# EAGLE design working (EAGLE 6.6.0)
COMPANY: ADAFRUIT INDUSTRIES; DRAWN: KTOWN; REV: B
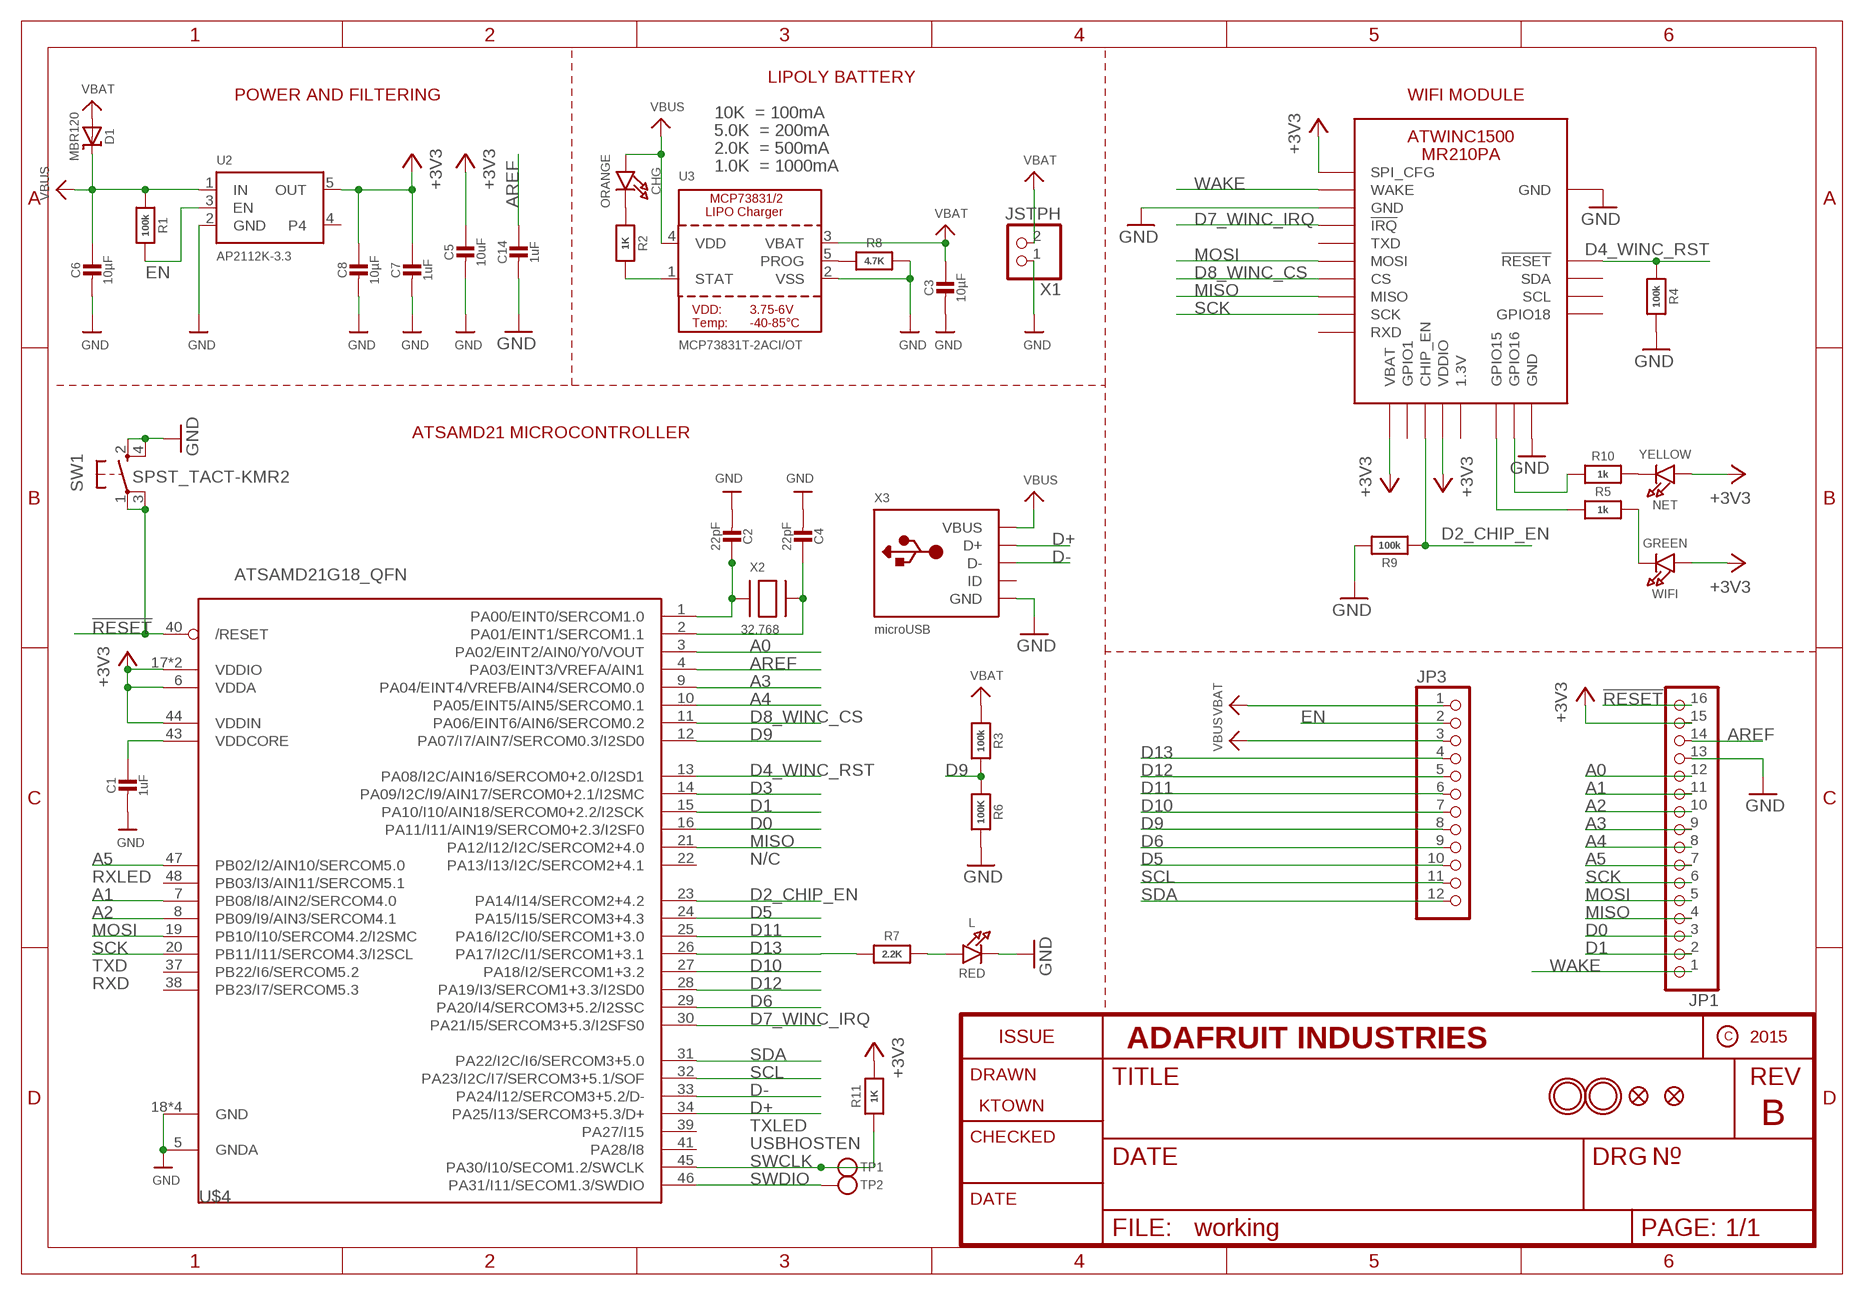
[diagram p0: schematic, sheet 1]

## Parts
C1  1uF  CAP_CERAMIC0603_NO  [0603-NO]
C2  22pF  CAP_CERAMIC0603_NO  [0603-NO]
C3  10µF  CAP_CERAMIC0805-NOOUTLINE  [0805-NO]
C4  22pF  CAP_CERAMIC0603_NO  [0603-NO]
C5  10uF  CAP_CERAMIC0805-NOOUTLINE  [0805-NO]
C6  10µF  CAP_CERAMIC0805-NOOUTLINE  [0805-NO]
C7  1uF  CAP_CERAMIC0603_NO  [0603-NO]
C8  10µF  CAP_CERAMIC0805-NOOUTLINE  [0805-NO]
C14  1uF  CAP_CERAMIC0603_NO  [0603-NO]
CHG  ORANGE  LED0805_NOOUTLINE  [CHIPLED_0805_NOOUTLINE]
D1  MBR120  DIODE-SCHOTTKYSOD-123  [SOD-123]
JP1  HEADER-1X16ROUND  [1X16_ROUND]
JP3  HEADER-1X12  [1X12_ROUND]
L  RED  LED0805_NOOUTLINE  [CHIPLED_0805_NOOUTLINE]
NET  YELLOW  LED0805_NOOUTLINE  [CHIPLED_0805_NOOUTLINE]
R1  100k  RESISTOR_0603_NOOUT  [0603-NO]
R2  1K  RESISTOR_0603_NOOUT  [0603-NO]
R3  100k  RESISTOR_0603_NOOUT  [0603-NO]
R4  100k  RESISTOR_0603_NOOUT  [0603-NO]
R5  1k  RESISTOR_0603_NOOUT  [0603-NO]
R6  100K  RESISTOR_0603_NOOUT  [0603-NO]
R7  2.2K  RESISTOR_0603_NOOUT  [0603-NO]
R8  4.7K  RESISTOR_0603_NOOUT  [0603-NO]
R9  100k  RESISTOR_0603_NOOUT  [0603-NO]
R10  1k  RESISTOR_0603_NOOUT  [0603-NO]
R11  1K  RESISTOR_0603_NOOUT  [0603-NO]
SW1  SPST_TACT-KMR2  [KMR2]
TP1  TESTPOINTROUND1.5MM  [TESTPOINT_ROUND_1.5MM]
TP2  TESTPOINTROUND1.5MM  [TESTPOINT_ROUND_1.5MM]
U2  AP2112K-3.3  VREG_SOT23-5  [SOT23-5]
U3  MCP73831T-2ACI/OT  MCP73831/2  [SOT23-5]
U$4  ATSAMD21G18_QFN  ATSAMD21J_QFN  [TQFN48_7MM]
U$31  MOUNTINGHOLE2.5  [MOUNTINGHOLE_2.5_PLATED]
U$32  MOUNTINGHOLE2.5  [MOUNTINGHOLE_2.5_PLATED]
U$34  FIDUCIAL""  [FIDUCIAL_1MM]
U$35  FIDUCIAL""  [FIDUCIAL_1MM]
WIFI  GREEN  LED0805_NOOUTLINE  [CHIPLED_0805_NOOUTLINE]
X1  JSTPH  CON_JST_PH_2PIN  [JSTPH2]
X2  32.768  XTAL-3.2X1.5  [XTAL3215]
X3  microUSB  USB_MICRO_20329_V2  [4UCONN_20329_V2]
X4  ATWINC1500_MR210PA  [ATWINC1500_MR210PA]

## Nets
!RESET: JP1.16 SW1.1(P) SW1.3(P1) U$4.40(/RESET)
+3V3: C5.1 C7.1 C8.1 JP1.15 NET.A R11.2 U2.5(OUT) U$4.6(VDDA) U$4.17(VDDIO) U$4.36(VDDIO) U$4.44(VDDIN) WIFI.A X4.J10(SPI_CFG) X4.J20(VBAT) X4.J23(VDDIO)
A0: JP1.12 U$4.3(PA02/EINT2/AIN0/Y0/VOUT)
A1: JP1.11 U$4.7(PB08/I8/AIN2/SERCOM4.0)
A2: JP1.10 U$4.8(PB09/I9/AIN3/SERCOM4.1)
A3: JP1.9 U$4.9(PA04/EINT4/VREFB/AIN4/SERCOM0.0)
A4: JP1.8 U$4.10(PA05/EINT5/AIN5/SERCOM0.1)
A5: JP1.7 U$4.47(PB02/I2/AIN10/SERCOM5.0)
AREF: C14.1 JP1.14 U$4.4(PA03/EINT3/VREFA/AIN1)
D0: JP1.3 U$4.16(PA11/I11/AIN19/SERCOM0+2.3/I2SF0)
D1: JP1.2 U$4.15(PA10/I10/AIN18/SERCOM0+2.2/I2SCK)
D2_CHIP_EN: R9.1 U$4.23(PA14/I14/SERCOM2+4.2) X4.J22(CHIP_EN)
D3: U$4.14(PA09/I2C/I9/AIN17/SERCOM0+2.1/I2SMC)
D4_WINC_RST: R4.1 U$4.13(PA08/I2C/AIN16/SERCOM0+2.0/I2SD1) X4.J4(!RESET)
D5: JP3.10 U$4.24(PA15/I15/SERCOM3+4.3)
D6: JP3.9 U$4.29(PA20/I4/SERCOM3+5.2/I2SSC)
D7_WINC_IRQ: U$4.30(PA21/I5/SERCOM3+5.3/I2SFS0) X4.J13(!IRQ)
D8_WINC_CS: U$4.11(PA06/EINT6/AIN6/SERCOM0.2) X4.J16(CS)
D9: JP3.8 R3.2 R6.1 U$4.12(PA07/I7/AIN7/SERCOM0.3/I2SD0)
D10: JP3.7 U$4.27(PA18/I2/SERCOM1+3.2)
D11: JP3.6 U$4.25(PA16/I2C/I0/SERCOM1+3.0)
D12: JP3.5 U$4.28(PA19/I3/SERCOM1+3.3/I2SD0)
D13: JP3.4 R7.1 U$4.26(PA17/I2C/I1/SERCOM1+3.1)
D+: U$4.34(PA25/I13/SERCOM3+5.3/D+) X3.D+
D-: U$4.33(PA24/I12/SERCOM3+5.2/D-) X3.D-
EN: JP3.2 R1.2 U2.3(EN)
GND: C1.2 C2.2 C3.2 C4.2 C5.2 C6.2 C7.2 C8.2 C14.2 JP1.13 L.C R4.2 R6.2 R8.2 R9.2 SW1.2(S) SW1.4(S1) U2.2(GND) U3.2(VSS) U$4.5(GNDA) U$4.18(GND) U$4.35(GND) U$4.42(GND) U$4.THERMAL(GND) X1.1 X3.BASE@1(GND) X3.BASE@2(GND) X3.GND X3.SPRT@1(GND) X3.SPRT@2(GND) X3.SPRT@3(GND) X3.SPRT@4(GND) X4.J9(GND) X4.J12(GND) X4.J28(GND) X4.MTGND(GND)
MISO: JP1.4 U$4.21(PA12/I12/I2C/SERCOM2+4.0) X4.J17(MISO)
MOSI: JP1.5 U$4.19(PB10/I10/SERCOM4.2/I2SMC) X4.J15(MOSI)
N$1: CHG.C R2.1
N$2: L.A R7.2
N$3: R2.2 U3.1(STAT)
N$4: R8.1 U3.5(PROG)
N$5: C2.1 U$4.1(PA00/EINT0/SERCOM1.0) X2.P$1
N$6: R5.1 X4.J26(GPIO15)
N$7: C4.1 U$4.2(PA01/EINT1/SERCOM1.1) X2.P$2
N$8: R10.1 X4.J27(GPIO16)
N$9: R5.2 WIFI.C
N$10: NET.C R10.2
SCK: JP1.6 U$4.20(PB11/I11/SERCOM4.3/I2SCL) X4.J18(SCK)
SCL: JP3.11 U$4.32(PA23/I2C/I7/SERCOM3+5.1/SOF)
SDA: JP3.12 U$4.31(PA22/I2C/I6/SERCOM3+5.0)
SWCLK: R11.1 TP1.P$1 U$4.45(PA30/I10/SECOM1.2/SWCLK)
SWDIO: TP2.P$1 U$4.46(PA31/I11/SECOM1.3/SWDIO)
VBAT: C3.1 D1.A JP3.1 R3.1 U3.3(VBAT) X1.2
VBUS: C6.1 CHG.A D1.C JP3.3 R1.1 U2.1(IN) U3.4(VDD) X3.VBUS
VDDCORE: C1.1 U$4.43(VDDCORE)
WAKE: JP1.1 X4.J11(WAKE)
Unconnected: U2.4 U$4.22(PA13/I13/I2C/SERCOM2+4.1) U$4.37(PB22/I6/SERCOM5.2) U$4.38(PB23/I7/SERCOM5.3) U$4.39(PA27/I15) U$4.41(PA28/I8) U$4.48(PB03/I3/AIN11/SERCOM5.1) X3.ID X4.J1(GPIO18) X4.J2(SCL) X4.J3(SDA) X4.J14(TXD) X4.J19(RXD) X4.J21(GPIO1) X4.J24(1.3V)

## Notes on the sheet
- LIPOLY BATTERY
- POWER AND FILTERING | WIFI MODULE
- 10K  = 100mA
- 5.0K  = 200mA
- 2.0K  = 500mA
- 1.0K  = 1000mA
- ATSAMD21 MICROCONTROLLER
- N/C
- RXLED
- TXD
- RXD
- TXLED
- USBHOSTEN

## Library data of the parts
C1-C8 C14 = microbuilder:CAP_CERAMIC: Ceramic Capacitors For new designs, use the packages preceded by an '_' character since they are more reliable: The following footprints should be used on most boards: _0402 - Standard footprint for regular board layouts _0603 - Standard footprint for regular board layouts _0805 - Standard footprint for regular board layouts _1206 - Standard footprint for regular board layouts For extremely tight-pitch boards where space is at a premium, the following 'micro-pitch' footprints can be used (smaller pads, no silkscreen outline, etc.): _0402MP - Micro-pitch footprint for very dense/compact boards _0603MP - Micro-pitch footprint for very dense/compact boards _0805MP - Micro-pitch footprint for very dense/compact boards _1206MP - Micro-pitch footprint for very dense/compact boards
CHG L NET WIFI = microbuilder:LED: LED 0603 - 0603 Surface Mount Package 2mA: Green LED - Low Power (3.9mcd, 2ma, 1.7Vf) - Digikey: 475-2709-2-ND Orange LED - Low Power (9.8mcd, 2ma, 1.8Vf) - Digikey: 475-1194-2-ND Red LED - Low Power (5mcd, 2ma, 1.8Vf) - Digikey: 475-1195-2-ND Yellow LED - Low Power (7mcd, 2ma, 1.8Vf) - Digikey: 475-1196-2-ND 5mA: Blue LED - Low Power (17mcd, 5ma, 2.9Vf) - Digikey: LNJ937W8CRACT-ND 0805 - 0805 Surface Mount Package 2mA: Red LED (8.8mcd, 2mA, 1.8Vf, Clear) - Low Power [Digikey: 475-2510-1-ND] Green LED (5mcd, 2mA, 1.8Vf, Clear) - Low Power [Digikey: 475-2730-1-ND] Yellow LED (11.3mcd, 2mA, 1.8Vf, Clear) - Low Power [Digikey: 475-2555-1-ND] 20mA: Red LED (104mcd, 20mA, Diffused) - LS R976 [Digikey: 475-1278-6-ND] Red LED (12mcd, 20mA, 2.0Vf, Clear) - APT2012EC [Digikey: 754-1128-1-ND] Green LED (15mcd, 20mA, 2.2Vf, Clear) - APT2012GC [Digikey: 754-1131-1-ND] Orange LED (160mcd, 20mA, 2.1Vf, Clear) - APT2012SECK [Digikey: 754-1130-1-ND] 1206 - 1206 Surface Mount Package Green LED (26mcd, 20mA, Diffused) - LG N971 [Digikey: 475-1407-6-ND] Red LED (15mcd, 20mA, Diffused) - LH N974 [Digikey: 475-1416-6-ND] Cree - Cree High-Power Surface Mount LEDs XPEBWT-L1-0000-00D50 - White 111lm 350mA 2.9Vf 6200K 110° XTEAWT-00-0000-00000LEE3 - White 114lm 350mA 2.85Vf 5000K 115° Everlight - Everlight 45-21 Series Surface Mount LEDs 45-21/QK2C-B2832AC2CB2/2T - Warm White 2000mcd 20mA 3.25Vf 3050K 120° 45-21/LK2C-B38452C4CB2/2T - Nuetral White 2000mcd 20mA 3.25Vf 4150K 120° 45-21/LK2C-B50634C6CB2/2T - Cold White 2200mcd 20mA 3.25Vf 5650K 120° PLCC2 Reverse Mount LS T77K-J1L2-1-0-2-R18-Z - Red 11.25mcd 2mA 1.8Vf 630nm 120° LO T77K-L1M2-24-Z - Orange 19.6mcd 2mA 1.8Vf 606nm 120° LY T77K-K2M1-26-Z - Yellow 15.7mcd 2mA 1.8Vf 587nm 120°
D1 = microbuilder:DIODE-SCHOTTKY
JP1 = microbuilder:HEADER-1X16: PIN HEADER
JP3 = microbuilder:HEADER-1X12
R1-R11 = microbuilder:RESISTOR: Resistors For new designs, use the packages preceded by an '_' character since they are more reliable: The following footprints should be used on most boards: _0402 - Standard footprint for regular board layouts _0603 - Standard footprint for regular board layouts _0805 - Standard footprint for regular board layouts _1206 - Standard footprint for regular board layouts For extremely tight-pitch boards where space is at a premium, the following 'micro-pitch' footprints can be used (smaller pads, no silkscreen outline, etc.): _0402MP - Micro-pitch footprint for very dense/compact boards _0603MP - Micro-pitch footprint for very dense/compact boards _0805MP - Micro-pitch footprint for very dense/compact boards _1206MP - Micro-pitch footprint for very dense/compact boards
SW1 = adafruit:SPST_TACT: SMT 6mm switch, EVQQ2 series http://www.ladyada.net/library/eagle
TP1 TP2 = microbuilder:TESTPOINT: Test Point Various test points for characterisation and PCB testing TESTPOINT_SMT - Compact Surface Mount Test Point [Digikey: 5016KTR-ND]
U2 = microbuilder:VREG_SOT23-5: SOT23-5 Fixed Voltage Regulators Part Current Out V Out V In V Dropout θJA (°C/W) TJ (°C) Digikey Part No. ADP121 150mA 3.3V 3.4-5.5V 0.09V @ 150mA -- -- ADP121-AUJZ33R7CT-ND ADP121 150mA 3.0V 3.1-5.5V 0.09V @ 150mA -- -- ADP121-AUJZ30R7CT-ND ADP122 300mA 3.3V 3.4-5.5V 0.085V @ 300mA -- -- ADP122AUJZ-3.3-R7CT-ND ADP1712 300mA 3.3V 3.5-5.5V 0.17V @ 300mA -- -- ADP1712AUJZ-3.3-R7TR-ND AP7311 (Low Cost) 150mA 3.3V 3.5-6V 0.15V @ 150mA -- -- AP7311-33WG-7DICT-ND LD39015M18R 150mA 1.8V 1.9V-5.5V 0.08V @ 100mA -- -- 497-6977-1-ND LP2985A-33DBVR 150mA 3.3V 3.3-16V 0.28V @ 150mA 206 150 296-18479-1-ND MCP1824T-3302E/OT 300mA 3.3V 3.5V-6V 0.2V @ 300mA -- -- MCP1824T-3302E/OTCT-ND MIC5205-2.5YM5 TR 150mA 2.5V 2.7-16V 0.165V @ 150mA -- -- 576-1257-2-ND MIC5205-3.0YM5 TR 150mA 3.0V 3.2V-16V 0.165V @ 150mA -- -- 576-1258-2-ND MIC5205-3.3YM5 TR 150mA 3.3V 3.5V-16V 0.165V @ 150mA -- -- 576-1259-2-ND TPS780330220 150mA 3.3V+2.2V 3.6-5.5V 250mV Max -- -- 296-23332-1-ND TDA3663/N1,135 100mA 3.3V 3.5-45V 0.18V @ 50mA -- -- 568-5343-1-ND Max operating temp can be calculated using θJA, TJ (max junction temperature), and power in watts. Set the "Maximum Ambient Temperature" until it reaches TJ ("Max Junction Temperature"), which is the absolute limit for safe use of the regulator: Heat Sink Temperature Calculator <http://www.daycounter.com/Calculators/Heat-Sink-Temperature-Calculator.phtml> For example, With 12V source into a 3.3V LP2985 and a 30mA load, we are dissipating (12V-3.3V) * 0.03A = 0.261W. With a θJA of 206 °C/W, a TJ of 150°C, and 261mW we can safely use the chip without a heat sink up to 75°C (=147.1°C Junction Temperature).
U3 = microbuilder:MCP73831/2: MCP73831/2 LIPO Charger VDD: 3.75 - 6V Temp -40 - 85°C Programmable Charge Rate: 15-500mA NOTE: STAT is a tri-state logic output on the MCP73831 and an open-drain output on the MCP73832. SOT23-5 with 4.2V output and tri-state logic on STAT = MCP73831T-2ACI/OT
U$4 = microbuilder:ATSAMD21J
U$31 U$32 = microbuilder:MOUNTINGHOLE: Mounting Hole For #2 screws (0.086"/2.18mm width, 0.094"/2.4mm hole) use 2.5mm; BOM: EXCLUDE
U$34 U$35 = microbuilder:FIDUCIAL: Fiducial Alignment Points Various fiducial points for machine vision alignment.; BOM: EXCLUDE
X1 = microbuilder:CON_JST_PH_2PIN: JST 2-Pin Right-Angle Connector PH-Series - 4UConnector: 17311 SH-Series - 4UConnector: 07278
X2 = adafruit2:XTAL: Low cost SMT crystals, no capacitors included http://www.ladyada.net/library/eagle
X3 = microbuilder:USB: USB Connectors USBMINIB - Surface Mount Female Mini-B USB Connector 4UConnector: 06564
X4 = microbuilder:ATWINC1500_MR210PA: ATWINC1500_MR210PA wifi module

## Board
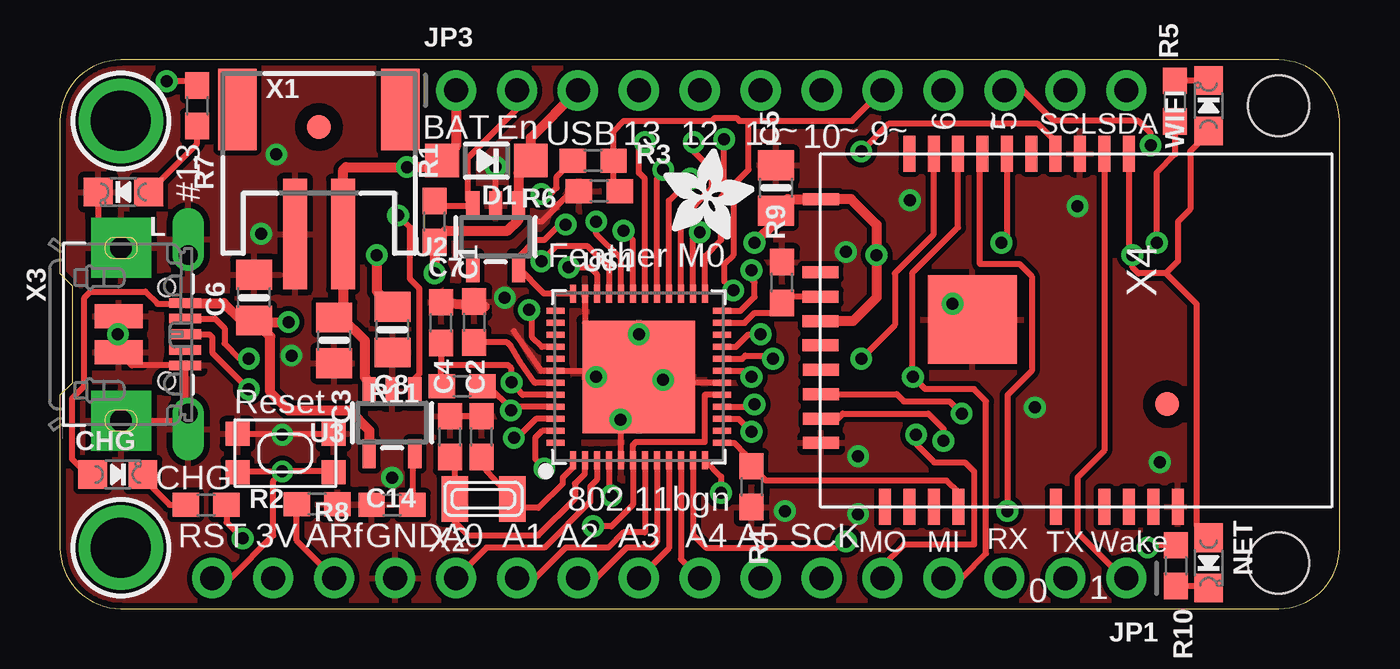
[diagram p1: board, top side]
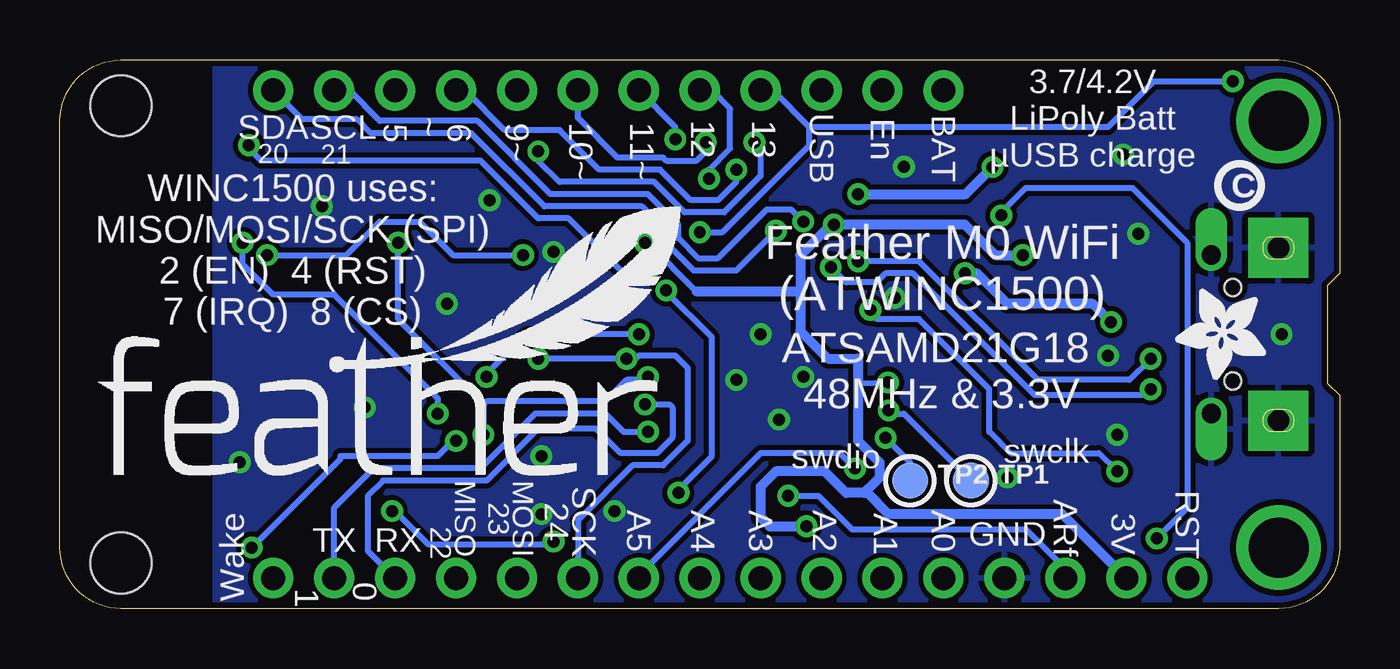
[diagram p2: board, bottom side, seen from below]

Size 53.34 x 22.86 mm. Coordinates in mm from the lower left corner, seen from the top.
Outline: 2.54,0 50.8,0 arc90 53.34,2.54 53.34,20.32 arc90 50.8,22.86 2.54,22.86 arc90 0,20.32 0,13.97 0.51,13.46 0.51,9.4 0,8.89 0,2.54 arc90 2.54,0
Copper layers (1*16): Top 0.035mm / dielectric 1.5mm / Bottom 0.035mm
Design rules "adafruit *": minimum track width 8mil, minimum drill 15.5mil, track to track 8mil, track to pad 8mil, pad to pad 8mil, via to via 8mil, smd to smd 8mil, copper to edge 10mil, drill to drill 8mil, minimum pad ring 10mil, minimum via ring 8mil, stop-mask expansion 2mil, vias tented up to drill 20mil, thermal gap 10mil
Holes 2.54 mm at 50.8,20.95 50.8,1.91
tRestrict: area 21.3,6.9 to 21.7,9.7; area 22.1,12.1 to 27.1,12.4; area 26.5,9.7 to 27.1,12.2
bRestrict: area 47.8,4.2 to 53.1,18.8

### Footprints (pad centres in the part's own frame; a part is rotated, then mirrored left to right if it is on the bottom)
0603-NO = smd 1.1 x 1: 1 -0.85,0; 2 0.85,0
0805-NO = smd 1.24 x 1.5: 1 -0.95,0; 2 0.95,0
CHIPLED_0805_NOOUTLINE = smd 1.2 x 1.2: A 0,-1.05; C 0,1.05
SOD-123 = smd 1.4 x 1.4: A 1.85,0; C -1.85,0
1X16_ROUND = drill 1 pad 1.676: 1 -19.05,0; 2 -16.51,0; 3 -13.97,0; 4 -11.43,0; 5 -8.89,0; 6 -6.35,0; 7 -3.81,0; 8 -1.27,0; 9 1.27,0; 10 3.81,0; 11 6.35,0; 12 8.89,0; 13 11.43,0; 14 13.97,0; 15 16.51,0; 16 19.05,0
1X12_ROUND = drill 1 pad 1.676: 1 -13.97,0; 2 -11.43,0; 3 -8.89,0; 4 -6.35,0; 5 -3.81,0; 6 -1.27,0; 7 1.27,0; 8 3.81,0; 9 6.35,0; 10 8.89,0; 11 11.43,0; 12 13.97,0
KMR2 = smd 1 x 1: 1 2,0.8; 2 2,-0.8; 3 -2,0.8; 4 -2,-0.8
TESTPOINT_ROUND_1.5MM = smd 1.5 x 1.5: P$1 0,0
SOT23-5 = smd 0.55 x 1.2: 1 -0.95,-1.3; 2 0,-1.3; 3 0.95,-1.3; 4 0.95,1.3; 5 -0.95,1.3
TQFN48_7MM = smd 0.25 x 0.75: 1 -2.75,-3.475; 2 -2.25,-3.475; 3 -1.75,-3.475; 4 -1.25,-3.475; 5 -0.75,-3.475; 6 -0.25,-3.475; 7 0.25,-3.475; 8 0.75,-3.475; 9 1.25,-3.475; 10 1.75,-3.475; 11 2.25,-3.475; 12 2.75,-3.475; 25 2.75,3.475; 26 2.25,3.475; 27 1.75,3.475; 28 1.25,3.475; 29 0.75,3.475; 30 0.25,3.475; 31 -0.25,3.475; 32 -0.75,3.475; 33 -1.25,3.475; 34 -1.75,3.475; 35 -2.25,3.475; 36 -2.75,3.475 | smd 0.75 x 0.25: 13 3.475,-2.75; 14 3.475,-2.25; 15 3.475,-1.75; 16 3.475,-1.25; 17 3.475,-0.75; 18 3.475,-0.25; 19 3.475,0.25; 20 3.475,0.75; 21 3.475,1.25; 22 3.475,1.75; 23 3.475,2.25; 24 3.475,2.75; 37 -3.475,2.75; 38 -3.475,2.25; 39 -3.475,1.75; 40 -3.475,1.25; 41 -3.475,0.75; 42 -3.475,0.25; 43 -3.475,-0.25; 44 -3.475,-0.75; 45 -3.475,-1.25; 46 -3.475,-1.75; 47 -3.475,-2.25; 48 -3.475,-2.75 | smd 4.7 x 4.7: THERMAL 0,0
MOUNTINGHOLE_2.5_PLATED = drill 2.5 pad 3.2: P$1 0,0
FIDUCIAL_1MM = smd 1 x 1: 1 0,0
JSTPH2 = smd 1 x 4.6: 1 -1,-3.7; 2 1,-3.7 | smd 1.6 x 3.4: NC1 -3.4,1.5; NC2 3.4,1.5
XTAL3215 = smd 1.1 x 1.9: P$1 1.2,0; P$2 -1.2,0
4UCONN_20329_V2 = smd 1 x 2: BASE@1 -0.75,-2; BASE@2 0.75,-2 | smd 0.4 x 1.35: D+ 0,0.775; D- -0.65,0.775; GND 1.3,0.775; ID 0.65,0.775; VBUS -1.3,0.775 | drill 0.8 pad 1.2 offset: SPRT@1 -3.3,0.9; SPRT@2 3.3,0.9 | drill 0.9 pad 2.5 square: SPRT@3 -3.6,-1.9; SPRT@4 3.6,-1.9 | hole 0.7: -1.95,0; 1.95,0
ATWINC1500_MR210PA = smd 1.5 x 0.5: J1 7.146,-4.973; J2 7.146,-3.957; J3 7.146,-2.941; J4 7.146,-1.925; J5 7.146,2.139; J6 7.146,4.171; J7 7.146,5.187; J8 7.146,6.203; J9 7.146,7.219; J10 -7.584,5.181; J11 -7.584,4.165; J12 -7.584,3.149; J13 -7.584,2.133; J14 -7.584,1.117; J15 -7.584,0.101; J16 -7.584,-0.915; J17 -7.584,-1.931; J18 -7.584,-2.947; J19 -7.584,-3.963 | smd 0.5 x 1.5: J20 -5.684,-7.643; J21 -2.636,-7.663; J22 -1.62,-7.663; J23 -0.604,-7.663; J24 0.412,-7.663; J25 1.428,-7.643; J26 2.444,-7.643; J27 3.46,-7.643; J28 4.476,-7.643 | smd 3.7 x 3.7: MTGND -0.666,-1.331

### Placement (x,y rotation side)
C1  17.27,11.94 90 top
C2  17.58,7.16 90 top
C3  11.43,11.18 270 top
C4  16.26,7.16 90 top
C5  29.84,17.53 90 top
C6  8.09,12.96 90 top
C7  15.89,11.91 90 top
C8  13.86,11.62 270 top
C14  10.72,4.34 0 top
CHG  2.41,5.59 270 top
D1  17.78,18.67 180 top
JP1  25.4,1.27 180 top
JP3  30.48,21.59 0 top
L  2.65,17.36 90 top
NET  47.88,1.91 180 top
R1  15.62,16.13 90 top
R2  6.1,4.32 0 top
R3  22.23,18.67 0 top
R4  28.83,5.08 270 top
R5  46.48,21.15 90 top
R6  22.48,17.4 180 top
R7  5.71,20.95 270 top
R8  13.84,4.32 180 top
R9  30.1,13.59 90 top
R10  46.52,1.79 270 top
R11  16.76,9.27 180 top
SW1  9.4,6.48 180 top
TP1  15.37,5.33 0 bottom
TP2  17.91,5.33 0 bottom
U2  18.16,15.49 180 top
U3  13.84,7.75 180 top
U$4  24.13,9.65 0 top
U$7  [ADAFRUIT_3.5MM]  25.15,15.37 0 top
U$9  [FEATHERLOGO]  51.77,5.49 0 bottom
U$12  [ADAFRUIT_3.5MM]  3.05,13.34 180 bottom
U$13  [PCBFEAT-REV-040]  4.17,17.63 0 bottom
U$31  2.54,20.32 270 top
U$32  2.54,2.54 270 top
U$34  10.79,20.07 270 top
U$35  46.15,8.52 270 top
WIFI  47.88,20.95 0 top
X1  10.79,19.3 0 top
X2  17.65,4.57 0 top
X3  4.45,11.43 270 top
X4  39.37,11.38 270 top

### Tracks (layer width: path | path; a pad name or v marks a point on that pad's centre or on a via)
!RESET  (via drill 0.5)
  Top 0.254: 6.48,1.27 JP1.16 7.11,1.27 8.89,3.05 8.89,5.33 v9.27,5.71 | v19.56,12.45 19.68,12.45 19.68,11.3 20.09,10.9 U$4.40 | SW1.1 7.44,5.71 v9.27,5.71 | SW1.3 11.36,5.71 v9.27,5.71
  Bottom 0.254: v9.27,5.71 10.03,6.48 13.72,6.48 14.61,7.37 14.61,9.14 17.53,12.06 19.3,12.06 19.56,12.32 v19.56,12.45
+3V3  (via drill 0.5)
  Top 0.254: U$4.44 19.29,8.9 v18.82,9.42 18.8,10.03 18.67,10.16 15.89,10.16 | v22.23,3.43 22.99,3.43 23.88,4.32 U$4.6 23.88,6.81 24,6.93 26.87,6.93 26.87,8.9 U$4.17 | U$4.36 20.18,13.13 U2.5 19.11,14.67 19.81,15.37 20.19,15.37 20.83,16 v21.08,16 | 46.1,13.97 46.61,14.48 46.61,16.13 47.12,16.64 47.12,19.05 47.88,19.81 WIFI.A | 46.1,13.97 44.96,13.97 44.7,14.22 v44.7,14.73 44.55,14.88 X4.J10 | 46.1,13.97 47.37,12.7 47.37,3.46 NET.A | C7.1 15.89,10.16 | R11.2 15.89,9.29 15.89,10.16
  Top 0.406: v13.21,14.73 13.21,13.22 C8.1 | 33.06,11.98 34.04,12.95 v34.04,14.73 34.04,16 32.98,17.06 X4.J20 30.33,17.06 C5.1 29.84,16.13 v28.96,15.24 | 33.06,11.98 | 33.06,11.98 X4.J23
  Bottom 0.254: 21.21,16 v21.08,16 | 26.8,13.21 28.83,15.24 v28.96,15.24 | v44.7,14.73 41.4,14.73 40.01,16.13 38.35,16.13 36.96,14.73 v34.04,14.73 | 20.07,9.27 19.94,9.4 v18.82,9.42
  Bottom 0.406: v22.23,3.43 23.75,3.43 24.13,3.81 24.13,5.08 23.5,5.71 21.46,5.71 20.57,4.83 19.81,4.83 19.68,4.95 | 21.21,16 22.48,14.73 22.48,13.21 | 22.48,13.21 22.48,11.56 21.34,10.41 20.07,10.41 20.07,9.27 20.07,6.99 19.18,6.1 19.18,5.46 19.68,4.95 | v13.21,14.73 14.35,14.73 15.62,16 v21.08,16 | 22.48,13.21 26.8,13.21 | JP1.15 11.56,3.94 18.8,3.94 19.68,4.83 19.68,4.95
A0
  Top 0.254: U$4.3 22.38,5.36 22.1,5.08 22.1,4.45 20.19,2.54 17.78,2.54 JP1.12
A1
  Top 0.254: U$4.7 24.38,4.31 24.38,3.17 23.5,3.17 22.86,2.54 21.08,2.54 19.81,1.27 JP1.11
A2
  Top 0.254: U$4.8 24.88,2.78 24.64,2.54 23.62,2.54 22.35,1.27 JP1.10 21.84,1.27
A3
  Top 0.254: U$4.9 25.38,2.52 JP1.9
A4
  Top 0.254: U$4.10 25.88,2.06 JP1.8
A5  (via drill 0.5)
  Top 0.254: U$4.47 20.1,7.4 19.81,7.11 19.81,6.22 v20.19,5.84
  Bottom 0.254: v20.19,5.84 20.83,6.48 24.13,6.48 29.21,1.4 JP1.7
AREF  (via drill 0.5)
  Top 0.254: JP1.14 9.87,2.83 C14.1 | U$4.4 22.88,4.81 v22.99,4.7
  Bottom 0.254: 11.43,1.78 JP1.14 11.43,1.65 13.08,3.3 20.32,3.3 21.72,4.7 v22.99,4.7
D0  (via drill 0.5)
  Top 0.254: U$4.16 28.85,8.4 v28.96,8.51
  Bottom 0.254: v28.96,8.51 27.94,8.51 27.81,8.38 27.81,7.11 28.45,6.48 29.97,6.48 30.99,7.49 33.4,7.49 35.56,5.33 39.88,5.33 40.51,4.7 40.51,2.41 JP1.3
D1  (via drill 0.5)
  Top 0.254: U$4.15 28.29,7.9 v28.83,7.37
  Bottom 0.254: JP1.2 41.91,4.19 40.26,5.84 35.81,5.84 33.53,8.13 30.61,8.13 29.84,7.37 v28.83,7.37
D2_CHIP_EN
  Top 0.254: U$4.23 28.54,11.9 28.96,12.32 29.84,12.32 30.1,12.57 R9.1 30.36,13 X4.J22
D4_WINC_RST
  Top 0.254: U$4.13 28.11,6.9 28.57,6.44 28.57,6.18 R4.1 29.43,5.33 36.96,5.33 37.45,4.85 X4.J4
D5  (via drill 0.5)
  Top 0.254: U$4.24 28.36,12.4 28.96,12.99 28.96,13.59 28.83,13.72 v28.83,14.1 | v45.47,19.3 45.47,19.43 45.47,19.81 44.96,20.32 41.4,20.32 40.13,21.59 JP3.10
  Bottom 0.254: v28.83,14.1 29.97,14.1 32.13,16.26 33.4,16.26 35.81,18.67 44.96,18.67 45.47,19.18 v45.47,19.3
D6  (via drill 0.5)
  Top 0.254: U$4.29 24.88,17.89 25.15,18.16 v25.15,18.29
  Bottom 0.254: JP3.9 36.45,21.59 34.8,19.94 32.51,19.94 30.86,18.29 28.32,18.29 27.05,17.02 25.91,17.02 25.15,17.78 v25.15,18.29
D7_WINC_IRQ  (via drill 0.5)
  Top 0.254: 24.38,19.18 v24.38,19.43 24.13,19.18 24.13,18.16 24.38,17.91 U$4.30 | v33.4,19.05 34.54,20.19 40.77,20.19 41.43,19.53 41.43,19.04 X4.J13
  Bottom 0.254: v24.38,19.43 24.13,19.18 24.13,18.03 25.65,16.51 27.3,16.51 28.57,17.78 32.51,17.78 33.4,18.67 v33.4,19.05
D8_WINC_CS  (via drill 0.5)
  Top 0.254: U$4.11 26.38,3.08 26.92,2.54 32.38,2.54 32.64,2.79 v32.77,2.79 | v39.5,4.06 39.5,8.89 40.51,9.91 40.51,13.84 40.01,14.35 38.35,14.35 38.35,18.86 X4.J16
  Bottom 0.254: v39.5,4.06 39.37,4.06 37.97,2.67 32.89,2.67 v32.77,2.79
D9  (via drill 0.5)
  Top 0.254: v28.07,13.26 27.69,13.64 27.69,14.35 28.07,14.73 28.07,16.89 28.19,17.02 28.19,17.78 28.7,18.29 28.7,20.32 | U$4.12 27.56,5.5 v27.56,4.83 | R6.1 23.07,17.65 R3.2 23.07,19.9 23.5,20.32 27.18,20.32 27.3,20.45 28.19,20.45 28.32,20.32 28.7,20.32 | 28.7,20.32 33.02,20.32 JP3.8
  Bottom 0.254: v27.56,4.83 27.56,4.95 26.16,6.35 26.16,11.3 28.07,13.21 v28.07,13.26
D10  (via drill 0.5)
  Top 0.254: U$4.27 25.88,16.23 27.18,17.53 27.18,18.29 26.42,19.05 v26.42,19.43
  Bottom 0.254: 31.62,21.46 JP3.7 31.75,20.45 30.1,18.8 28.19,18.8 28.07,18.67 26.8,18.67 26.42,19.05 v26.42,19.43
D11  (via drill 0.5)
  Top 0.254: U$4.25 26.88,14.69 27.56,15.37 27.56,17.14 27.69,17.27 v27.69,19.56
  Bottom 0.254: v27.69,19.56 27.69,20.07 JP3.6
D12  (via drill 0.5)
  Top 0.254: U$4.28 25.38,17 v26.29,17.91
  Bottom 0.254: v26.29,17.91 26.29,18.29 25.4,19.18 25.4,20.83 26.16,21.59 JP3.5
D13  (via drill 0.5)
  Top 0.254: U$4.26 26.38,15.39 v26.67,15.68 | R7.1 5.55,21.97 v4.45,21.97
  Bottom 0.254: 22.1,20.07 9.65,20.07 7.75,21.97 v4.45,21.97 | v26.67,15.68 25.72,15.68 22.1,19.3 22.1,20.07 | 22.1,20.07 23.62,21.59 JP3.4
D+  (via drill 0.5)
  Top 0.254: X3.D+ 6.22,11.43 6.35,11.3 6.35,10.67 v7.87,9.14 | v21.21,14.22 22.1,14.22 22.38,13.94 U$4.34
  Bottom 0.254: v7.87,9.14 8.13,8.89 12.7,8.89 17.78,13.97 18.92,13.97 19.3,13.59 20.57,13.59 v21.21,14.22
D-  (via drill 0.5)
  Top 0.254: X3.D- 6.46,12.08 6.86,11.68 6.86,11.05 7.49,10.41 v7.87,10.41 | v20.07,14.48 20.7,15.11 21.97,15.11 22.88,14.2 U$4.33
  Bottom 0.254: v7.87,10.41 8.76,9.53 12.57,9.53 17.53,14.48 v20.07,14.48
EN
  Top 0.254: JP3.2 19.05,20.83 17.02,18.8 17.02,16.99 U2.3 15.81,16.79 R1.2
GND  (via drill 0.5)
  Top 0.254: L.C 1.59,15.03 X3.SPRT@3 | X3.BASE@2 3,10.13 X3.GND 5.22,8.26 X3.SPRT@2 5.04,7.83 X3.SPRT@4 | SW1.2 SW1.4 11.52,7.28 | 13.97,10.67 C8.2 | U$4.35 21.88,11.9 U$4.THERMAL | U$4.THERMAL 23.88,9.9 U$4.42 20.2,9.9 20.19,9.91 20.07,9.91 18.92,11.56 | U$4.5 23.38,8.9 | 23.38,8.9 U$4.THERMAL | U$4.18 24.38,9.4 U$4.THERMAL | C2.2 C4.2 | U2.2 18.16,18.03 | R6.2 21.34,17.4 20.07,16.13 19.94,16.13 | 23.38,8.9 23.37,8.89 v23.37,7.87 | v37.21,12.7 37.87,12.04 X4.MTGND
  Top 0.406: C7.2 17.7,12.59 C1.2
  other vias: 2.41,11.43 9.65,10.54 9.02,18.92 13.84,5.46 9.27,7.24 18.54,12.95 18.16,18.41 22.35,9.65 24.13,11.43 25.15,9.53 8.38,15.62 33.27,6.35 33.27,3.94 45.85,6.1 42.42,16.76 32.77,14.86 40.64,8.38 35.43,17.02 30.23,4.06
  pour Top: 0,22.86 0,0 46.86,0 46.86,22.86
  pour Bottom: 46.86,0 0,0 0,22.86 46.86,22.86
MISO  (via drill 0.5)
  Top 0.254: U$4.21 28.17,10.9 28.7,11.43 v29.21,11.43 | JP1.4 37.59,1.27 38.61,2.29 38.61,8.64 38.1,9.14 36.07,9.14 v35.56,9.65 35.52,9.69 35.52,13.97 37.44,15.88 X4.J17
  Bottom 0.254: v29.21,11.43 33.91,11.43 35.56,9.78 v35.56,9.65
MOSI  (via drill 0.5)
  Top 0.254: U$4.19 28.71,9.9 28.71,9.78 v28.83,9.65 | v35.69,7.24 35.69,6.86 36.45,6.1 37.72,6.1 38.1,5.71 38.1,2.67 35.18,2.67 34.29,1.78 JP1.5 | X4.J15 39.47,15.47 v39.24,15.24
  Bottom 0.254: v28.83,9.65 28.96,9.53 29.72,9.53 30.61,8.64 35.56,8.64 35.69,8.51 | 35.69,8.51 39.24,12.06 v39.24,15.24 | 35.69,8.51 v35.69,7.24
N$1
  Top 0.254: CHG.C 3.46,5.43 4.57,4.32 R2.1
N$2
  Top 0.254: L.A 5.71,19.38 R7.2
N$3  (via drill 0.5)
  Top 0.254: 14.89,9.05 U3.1 14.79,9.59 14.99,9.78 14.99,13.34 14.61,13.72 14.61,15.88 v14.1,16.38 | R2.2 6.95,3.6 v7.62,2.92
  Bottom 0.254: v7.62,2.92 6.35,4.19 6.35,15.24 8.64,17.53 13.08,17.53 14.1,16.51 v14.1,16.38
N$4
  Top 0.254: U3.5 14.69,6.35 R8.1
N$5
  Top 0.254: U$4.1 21.38,5.89 20.95,5.46 20.95,5.21 19.94,4.19 19.36,4.19 X2.P$1 17.65,5.9 C2.1
N$6  (via drill 0.5)
  Top 0.254: R5.1 46.48,18.92 45.72,18.16 v45.72,15.24 | X4.J26 34.88,8.94 35.18,8.64 37.08,8.64 v37.59,8.13
  Bottom 0.254: v45.72,15.24 45.72,14.35 44.45,13.08 41.91,13.08 37.59,8.76 v37.59,8.13
N$7
  Top 0.254: U$4.2 21.88,5.62 21.46,5.21 21.46,4.57 19.94,3.05 17.02,3.05 16.45,3.61 X2.P$2 16.45,6.57 C4.1
N$8  (via drill 0.5)
  Top 0.254: X4.J27 32.43,7.92 32.64,8.13 36.2,8.13 36.83,7.49 v36.83,6.99 | R10.1 45.44,2.64 v45.34,2.54
  Bottom 0.254: v36.83,6.99 36.83,7.11 37.59,6.35 41.66,6.35 41.66,6.22 v45.34,2.54
N$9
  Top 0.254: WIFI.C 46.49,22 R5.2
N$10
  Top 0.254: R10.2 47.79,0.94 NET.C
SCK  (via drill 0.5)
  Top 0.254: v33.4,10.41 34.8,11.81 34.8,13.97 36.43,15.6 36.42,15.61 X4.J18 | v29.72,10.4 v29.72,10.41 29.59,10.54 28.57,10.54 28.44,10.4 U$4.20
  Bottom 0.254: v33.4,10.41 v29.72,10.41 29.34,10.41 29.21,10.54 27.69,10.54 27.18,10.03 27.18,6.99 28.19,5.97 29.46,5.97 31.75,3.68 JP1.6
SCL  (via drill 0.5)
  Top 0.254: U$4.32 23.38,14.59 22.35,15.62 v22.35,16.13 22.35,16
  Bottom 0.254: JP3.11 41.27,21.59 40.01,20.32 35.94,20.32 32.89,17.27 28.83,17.27 27.56,16 27.56,15.43 26.73,14.61 25.91,14.61 23.88,16.64 22.86,16.64 v22.35,16.13
SDA  (via drill 0.5)
  Top 0.254: U$4.31 23.88,15.36 v23.5,15.75
  Bottom 0.254: JP3.12 43.24,20.38 40.96,20.38 40.39,19.81 36.2,19.81 33.15,16.76 29.08,16.76 28.07,15.75 28.07,15.24 26.92,14.1 25.15,14.1 v23.5,15.75
SWCLK  (via drill 0.5)
  Top 0.254: U$4.45 19.2,8.4 v18.8,8.26 18.8,8.33 17.86,9.27 R11.1
  Bottom 0.254: v18.8,8.26 18.92,8.13 18.16,8.13 TP1.P$1
SWDIO  (via drill 0.5)
  Top 0.254: U$4.46 19.84,7.9 19.05,7.11 v18.92,7.11
  Bottom 0.254: 19.05,7.11 v18.92,7.11 17.91,6.1 TP2.P$1
VBAT  (via drill 0.5)
  Top 0.254: X1.2 11.81,15.62 | R3.1 20.7,18 20.7,17.53 20.45,17.27 v20.07,17.27 | 11.79,12.49 C3.1
  Top 0.406: 11.81,15.62 11.81,18.29 11.92,18.4 v14.46,18.4 15.66,18.4 D1.A 16.51,19.25 JP3.1 | X1.2 11.79,12.49 | C3.1 11.75,12.13 12.7,11.18 12.7,9.65 12.89,9.46 U3.3
  Bottom 0.406: v20.07,17.27 15.59,17.27 v14.46,18.4
VBUS  (via drill 0.5)
  Top 0.254: CHG.A 1.14,5.59 0.51,6.22 0.51,8.76 1.02,9.27 1.02,12.95 1.27,13.21 3.56,13.21 4.06,12.7 5.19,12.7 X3.VBUS | 7.55,12.01 C6.1 8.16,11.94
  Top 0.406: X3.VBUS 6.83,12.73 7.55,12.01 | JP3.3 19.63,19.63 D1.C 19.11,18.15 U2.1 19.11,16.19 18.67,15.75 16.09,15.75 R1.1 v15.62,13.97 | U3.4 12.89,7.43 12.06,8.26 9.53,8.26 8.76,9.02 8.76,11.33 C6.1 | 8.16,11.94 v9.53,11.94
  Bottom 0.406: v9.53,11.94 10.29,12.7 13.84,12.7 15.11,13.97 v15.62,13.97
VDDCORE
  Top 0.254: U$4.43 19.81,9.4 19.18,10.29 18.8,10.92 18.63,11.09 C1.1
WAKE
  Top 0.254: JP1.1 44.32,1.27 42.42,3.17 42.42,5.46 43.53,6.58 X4.J11

### Text on the board
tPlace: BAT | En | USB | 13 | 12 | 11 | ~ | 10 | ~ | 9 | ~ | 6 | ~ | 5 | SCL | SDA | #13 | Feather M0 | Reset | CHG | 802.11bgn | RST | 3V | ARf | GND | A0 | A1 | A2 | A3 | A4 | A5 | SCK | MO | MI | RX | TX | Wake | 0 | 1
bPlace: 3.7/4.2V / LiPoly Batt / µUSB charge | En | 13 | 12 | 6 | ~ | 5 | SCL | SDA | BAT | USB | 11~ | 10~ | 9~ | 21 | 20 | WINC1500 uses: / MISO/MOSI/SCK (SPI) / 2 (EN) 4 (RST) / 7 (IRQ) 8 (CS) | Feather M0 WiFi / (ATWINC1500) | ATSAMD21G18 / 48MHz & 3.3V | swclk | swdio | SCK | 24 | MOSI | 23 | MISO | RST | 3V | ARf | GND | A0 | A1 | A2 | A3 | A4 | A5 | 22 | RX | TX | Wake | 0 | 1